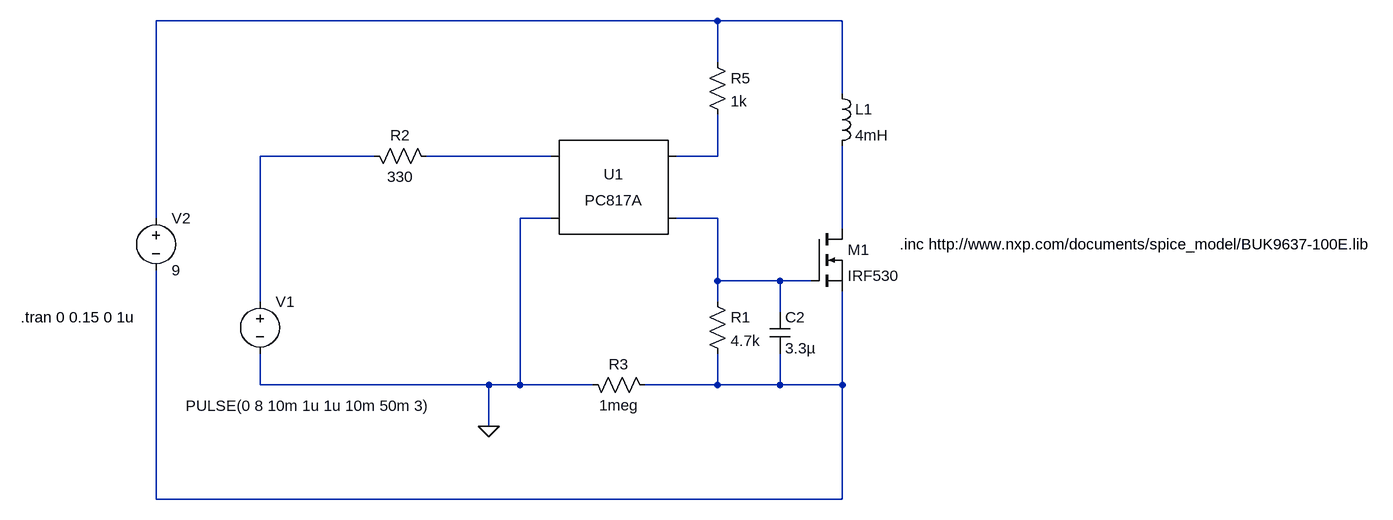
[diagram p0: schematic Solenoid 2.asc]
Solenoid 2.asc, the LTspice schematic file:
Version 4
SHEET 1 1732 680
WIRE 576 -160 -288 -160
WIRE 768 -160 576 -160
WIRE 576 -96 576 -160
WIRE 768 -48 768 -160
WIRE 48 48 -128 48
WIRE 320 48 128 48
WIRE 576 48 576 -16
WIRE 576 48 512 48
WIRE -288 144 -288 -160
WIRE 320 144 272 144
WIRE 576 144 512 144
WIRE 768 160 768 32
WIRE 576 240 576 144
WIRE 672 240 576 240
WIRE 720 240 672 240
WIRE -128 272 -128 48
WIRE 576 272 576 240
WIRE 672 288 672 240
WIRE -128 400 -128 352
WIRE 224 400 -128 400
WIRE 272 400 272 144
WIRE 272 400 224 400
WIRE 384 400 272 400
WIRE 576 400 576 352
WIRE 576 400 464 400
WIRE 672 400 672 352
WIRE 672 400 576 400
WIRE 768 400 768 256
WIRE 768 400 672 400
WIRE 224 464 224 400
WIRE -288 576 -288 224
WIRE 768 576 768 400
WIRE 768 576 -288 576
FLAG 224 464 0
SYMBOL nmos 720 160 R0
SYMATTR InstName M1
SYMATTR Value IRF530
SYMBOL ind 752 -64 R0
SYMATTR InstName L1
SYMATTR Value 4mH
SYMATTR SpiceLine Rser=6
SYMBOL voltage -128 256 R0
WINDOW 3 -114 176 Left 2
WINDOW 123 0 0 Left 2
SYMATTR Value PULSE(0 8 10m 1u 1u 10m 50m 3)
SYMATTR InstName V1
SYMATTR SpiceLine Rser=10
SYMBOL voltage -288 128 R0
WINDOW 123 0 0 Left 2
SYMATTR InstName V2
SYMATTR Value 9
SYMATTR SpiceLine Rser=1
SYMBOL res 560 256 R0
SYMATTR InstName R1
SYMATTR Value 4.7k
SYMBOL Optos\\PC817A 416 96 R0
SYMATTR InstName U1
SYMBOL res 32 32 M90
WINDOW 0 0 56 VBottom 2
WINDOW 3 32 56 VTop 2
SYMATTR InstName R2
SYMATTR Value 330
SYMBOL res 368 384 M90
WINDOW 0 0 56 VBottom 2
WINDOW 3 32 56 VTop 2
SYMATTR InstName R3
SYMATTR Value 1meg
SYMBOL res 560 -112 R0
SYMATTR InstName R5
SYMATTR Value 1k
SYMBOL cap 656 288 R0
SYMATTR InstName C2
SYMATTR Value 3.3µ
TEXT -496 296 Left 2 !.tran 0 0.15 0 1u
TEXT 856 184 Left 2 !.inc http://www.nxp.com/documents/spice_model/BUK9637-100E.lib

The netlist it stands for:
* Solenoid 2.asc
M1 N006 N005 N007 N007 IRF530
L1 N001 N006 4mH Rser=6
V1 N002 0 PULSE(0 8 10m 1u 1u 10m 50m 3) Rser=10
V2 N001 N007 9 Rser=1
R1 N005 N007 4.7k
XU1 N003 0 N004 N005 PC817 Igain=1m
R2 N002 N003 330
R3 0 N007 1meg
R5 N001 N004 1k
C2 N005 N007 3.3µ
.model NMOS NMOS
.model PMOS PMOS
.lib standard.mos
.tran 0 0.15 0 1u
.inc http://www.nxp.com/documents/spice_model/BUK9637-100E.lib
.lib PC817.sub
.backanno
.end